# Altium schematic sheet Przelacznik_zasilania_Monitoringu.SchDoc
size A
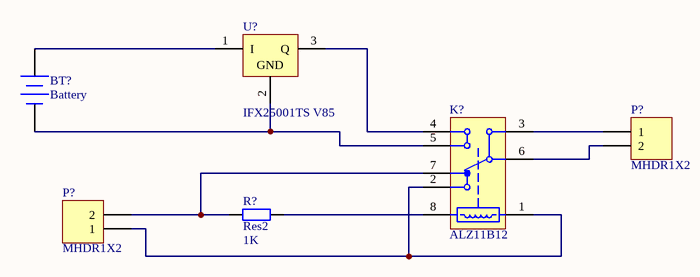
[diagram p0: Przelacznik_zasilania_Monitoringu.SchDoc]

## Parts
(Parts that share a designator on the sheet are numbered #1, #2 ... from top to bottom, then left to right.)
BT?  Battery  [BAT-2]
K?  ALZ11B12  [PNSC-LZ-8-2880x1250x1570_V]
P?#1  MHDR1X2  [MHDR1X2]
P?#2  MHDR1X2  [MHDR1X2]
R?  Res2  value 1K  [AXIAL-0.4]
U?  IFX25001TS V85  [INF-PG-TO220-3-1]

## Nets
NetBT?_1: BT?.1(+) U?.1(I)
NetBT?_2: BT?.2(-) K?.5 U?.2(GND)
NetK?_1: K?.1 K?.2 P?#2.1
NetK?_3: K?.3 P?#1.1
NetK?_4: K?.4 U?.3(Q)
NetK?_6: K?.6 P?#1.2
NetK?_7: K?.7 P?#2.2 R?.1
NetK?_8: K?.8 R?.2

## Library data of the parts
BT? = Battery: Multicell Battery; Published: 24-Mar-1999; LatestRevisionDate: 17-Jul-2002; LatestRevisionNote: Re-released for DXP Platform.; PackageReference: BAT-2; Publisher: Altium Limited; PackageDescription: Battery; 2 Leads
K? = ALZ11B12: LZ Relays, 12 V Coil Voltage, 400 mW Nominal Operating Power, -40 to 85 degC, 8-Pin LZ, Carton, Case, RoHS; Manufacturer: Panasonic; Coil Voltage: 12 V; Electrical Life: 1x10^5 (N.O.), 5x10^4 (N.C.); Max Switching Current: 16 A; Max Switching Voltage: 440 V AC; Mechanical Life(Min.operation): 1x10^7; Nominal Operating Power: 400 mW; Pb-Free: True; DatasheetVersion: 201402-T; PackageVersion: ASCTB203E, 02/2014; PackageReference: LZ-8-2880x1250x1570; PackageDescription: 8-Pin Through Hole Terminal Package, Body 28.8 x 12.5 mm; Supplier 1: Mouser; Supplier Part Number 1: 769-ALZ11B12; Supplier 2: Digi-Key; Supplier Part Number 2: ALZ11B12-ND; Packing: Carton, Case; RoHS: True; Series: LZ Relays; Mounting Technology: Through Hole; PartNumber: ALZ11B12; ComponentLink1Description: Manufacturer URL; ComponentLink1URL: http://www3.panasonic.biz/ac/ae/index.jsp; ComponentLink2Description: Datasheet; ComponentLink2URL: http://www3.panasonic.biz/ac/e_download/control/relay/power/catalog/mech_eng_lz.pdf?f_cd=300372; ComponentLink3Description: Package Specification; ComponentLink3URL: http://www3.panasonic.biz/ac/e_download/control/relay/power/catalog/mech_eng_lz.pdf?f_cd=300372
P?#1 P?#2 = MHDR1X2: Header, 2-Pin; LatestRevisionDate: 17-Jul-2002; LatestRevisionNote: Re-released for DXP Platform.; Publisher: Altium Limited
R? = Res2: Resistor; Published: 8-Jun-2000; LatestRevisionDate: 17-Jul-2002; LatestRevisionNote: Re-released for DXP Platform.; PackageReference: AXIAL-0.4; Publisher: Altium Limited; PackageDescription: Axial Device, Thru-Hole; 2 Leads; 0.4 in Pin Spacing
U? = IFX25001TS V85: Low Dropout Voltage Regulator, 9 to 40 V Operating, 400 mA, -40 to 125 degC, PG-TO220-3-1, Reel, Green; Manufacturer: Infineon; Accuracy: 4.0 %; Automotive Qualified: FALSE; Dropout Voltage: 250 mV; Green: TRUE; Max. Output Current: 400 mA; Output Voltage: 8.5 V; Regulator Type: Linear->single output; Typical Quiescent Current: 100 uA; DatasheetVersion: Rev. 1.02; PackageVersion: Jul-12; PackageReference: PG-TO220-3-1; PackageDescription: 3-Pin Plastic (Green) Transistor Single Outline Package, 10 x 9.25 mm Body, 2.54 mm Pitch; Supplier 1: Mouser; Supplier Part Number 1: 726-IFX25001TSV85; Supplier 2: Digi-Key; Supplier Part Number 2: IFX25001TS V85-ND; Halogen-free: TRUE; Packing: Reel; Reset: FALSE; Status Output: FALSE; Mounting Technology: Through Hole; PartNumber: IFX25001TS V85; ComponentLink1Description: Manufacturer URL; ComponentLink1URL: http://www.infineon.com/; ComponentLink2Description: Datasheet; ComponentLink2URL: http://www.infineon.com/dgdl/IFX25001_DS_102.pdf?folderId=db3a30431ff988150120802bce1d257a&fileId=db3a304320d39d590120f620f1e269da; ComponentLink3Description: Package Specification; ComponentLink3URL: http://www.infineon.com/dgdl/BTS117_DS_14.pdf?folderId=db3a30431400ef68011421b54e2e0564&fileId=db3a30433a747525013abff8302d549c&location=en.Products.Automotive_ICs.Smart_High-_and_Low-Side_Switches.HITFET___TEMPFET__-_Smart_Low-Side_Switches.DATASHEET.BTS117_DS_14.pdf